# EAGLE design RFID (EAGLE 7.2.0)
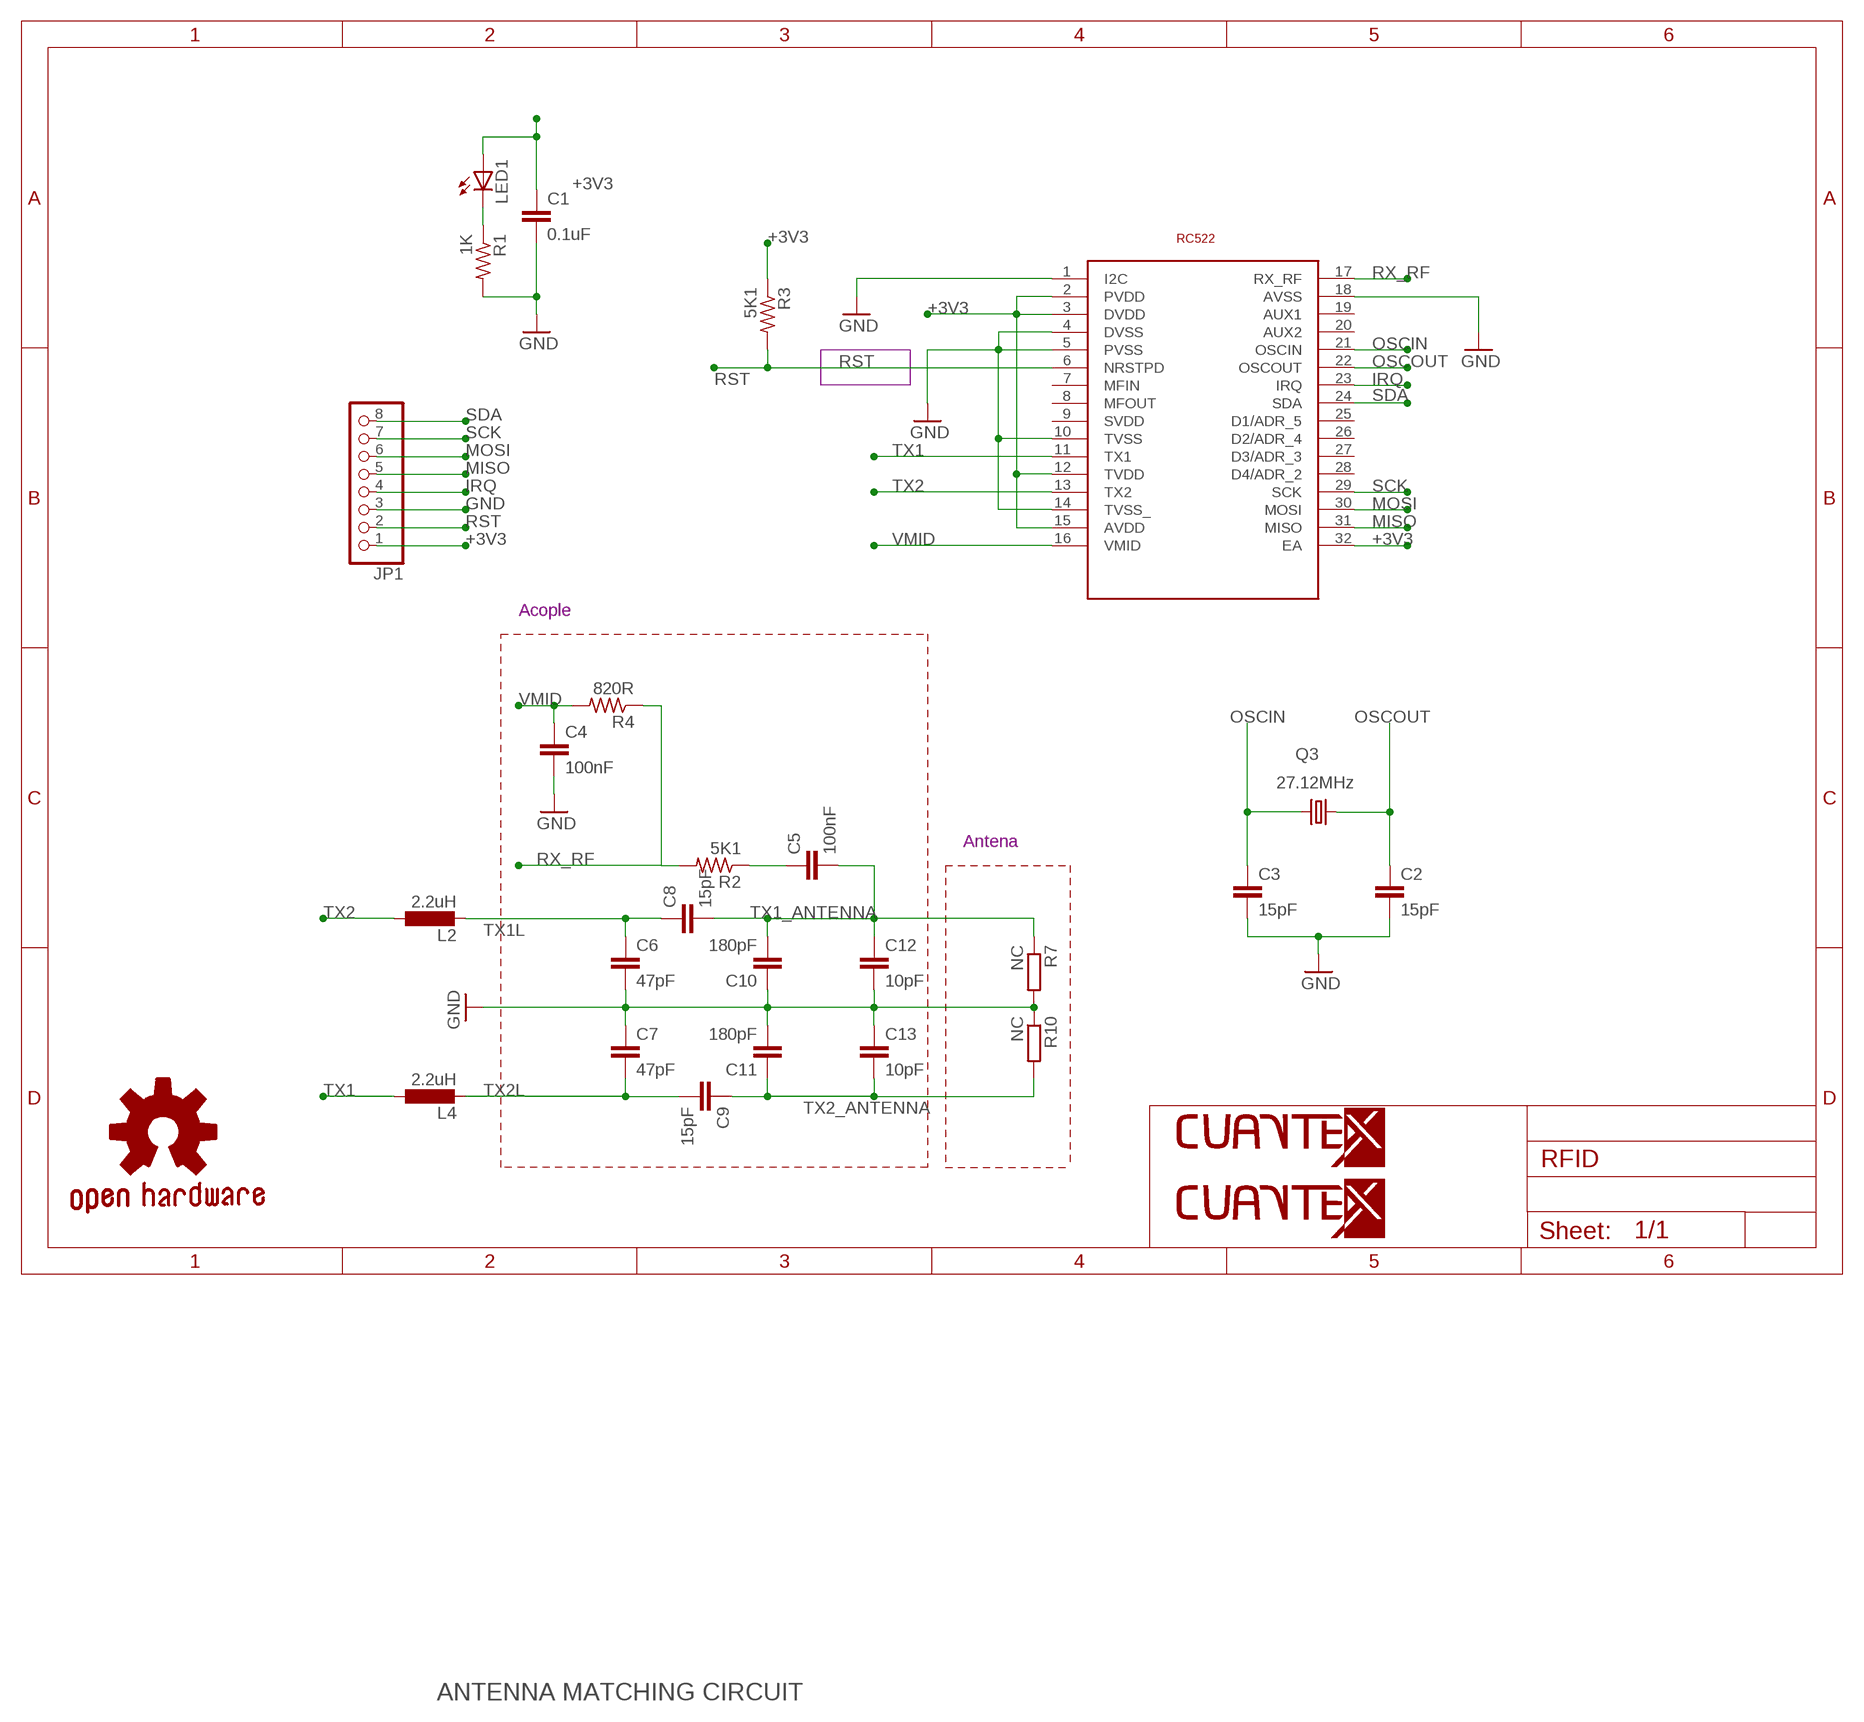
[diagram p0: schematic, sheet 1]

## Parts
C1  0.1uF  C-EUC0603K  [C0603K]
C2  15pF  C-EUC0603K  [C0603K]
C3  15pF  C-EUC0603K  [C0603K]
C4  100nF  C-EUC0603K  [C0603K]
C5  100nF  C-EUC0603K  [C0603K]
C6  47pF  C-EUC0603K  [C0603K]
C7  47pF  C-EUC0603K  [C0603K]
C8  15pF  C-EUC0603K  [C0603K]
C9  15pF  C-EUC0603K  [C0603K]
C10  180pF  C-EUC0603K  [C0603K]
C11  180pF  C-EUC0603K  [C0603K]
C12  10pF  C-EUC0603K  [C0603K]
C13  10pF  C-EUC0603K  [C0603K]
GOLD_ORB_SM1  OSHWLOGO_GOLD_ORB_SM  [OSHW2]
JP1  PINHD-1X8  [1X08]
L2  2.2uH  L-EUL2012C  [L2012C]
L4  2.2uH  L-EUL2012C  [L2012C]
LED1  LED_E  [LED_1206]
Q3  27.12MHz  CRYSTALHC49UP  [HC49UP]
R1  1K  R-US_R0603  [R0603]
R2  5K1  R-US_R0603  [R0603]
R3  5K1  R-US_R0603  [R0603]
R4  820R  R-US_R0603  [R0603]
R7  NC  R-EU_R0201  [R0201]
R10  NC  R-EU_R0201  [R0201]
U1  RC522  [HVQFN32]
U$1  LOGO-BOT-50MM  [B-50]
U$2  LOGO-TOP-20MM  [C-0]

## Nets
+3V3: C1.1 JP1.1 LED1.A R3.1 U1.2(PVDD) U1.3(DVDD) U1.12(TVDD) U1.15(AVDD) U1.32(EA)
GND: C1.2 C2.2 C3.2 C4.2 C6.2 C7.1 C10.1 C11.2 C12.2 C13.1 JP1.3 R1.2 R7.2 R10.1 U1.1(I2C) U1.4(DVSS) U1.5(PVSS) U1.10(TVSS) U1.14(TVSS_) U1.18(AVSS)
IRQ: JP1.4 U1.23(IRQ)
MISO: JP1.5 U1.31(MISO)
MOSI: JP1.6 U1.30(MOSI)
N$1: LED1.C R1.1
N$13: C5.1 R2.1
OSCIN: C3.1 Q3.2 U1.21(OSCIN)
OSCOUT: C2.1 Q3.1 U1.22(OSCOUT)
RST: JP1.2 R3.2 U1.6(NRSTPD)
RX_RF: R2.2 R4.1 U1.17(RX_RF)
SCK: JP1.7 U1.29(SCK)
SDA: JP1.8 U1.24(SDA)
TX1: L4.1 U1.11(TX1)
TX1_ANTENNA: C5.2 C8.2 C10.2 C12.1 R7.1
TX1L: C6.1 C8.1 L2.2
TX2: L2.1 U1.13(TX2)
TX2_ANTENNA: C9.1 C11.1 C13.2 R10.2
TX2L: C7.2 C9.2 L4.2
VMID: C4.1 R4.2 U1.16(VMID)
Unconnected: U1.7(MFIN) U1.8(MFOUT) U1.9(SVDD) U1.19(AUX1) U1.20(AUX2) U1.25(D1/ADR_5) U1.26(D2/ADR_4) U1.27(D3/ADR_3) U1.28(D4/ADR_2)

## Notes on the sheet
- Acople
- Antena
- ANTENNA MATCHING CIRCUIT

## Library data of the parts
C1 = resistor:C-EU: CAPACITOR, European symbol
C2-C13 = rcl:C-EU: CAPACITOR, European symbol
GOLD_ORB_SM1 = OPENHW:OSHWLOGO: These are Open-Source Hardware logos.
JP1 = pinhead:PINHD-1X8: PIN HEADER
L2 L4 = resistor:L-EU: INDUCTOR, European symbol
LED1 = eagle-ltspice:LED_E: LED Source: http://www.osram.convergy.de Source: www.luxeon.com Source: www.kingbright.com; SPICEMODEL: NONE; SPICEPREFIX: D; SPICETYPE: diode
Q3 = crystal:CRYSTAL: CRYSTAL; OC_FARNELL: unknown; OC_NEWARK: unknown
R1-R4 = rcl:R-US_: RESISTOR, American symbol
R7 R10 = rcl:R-EU_: RESISTOR, European symbol
U1 = MaoLib:RC522
U$1 = LOGOTIPOS:LOGO-BOT-50MM
U$2 = LOGOTIPOS:LOGO-TOP-20MM

## Board
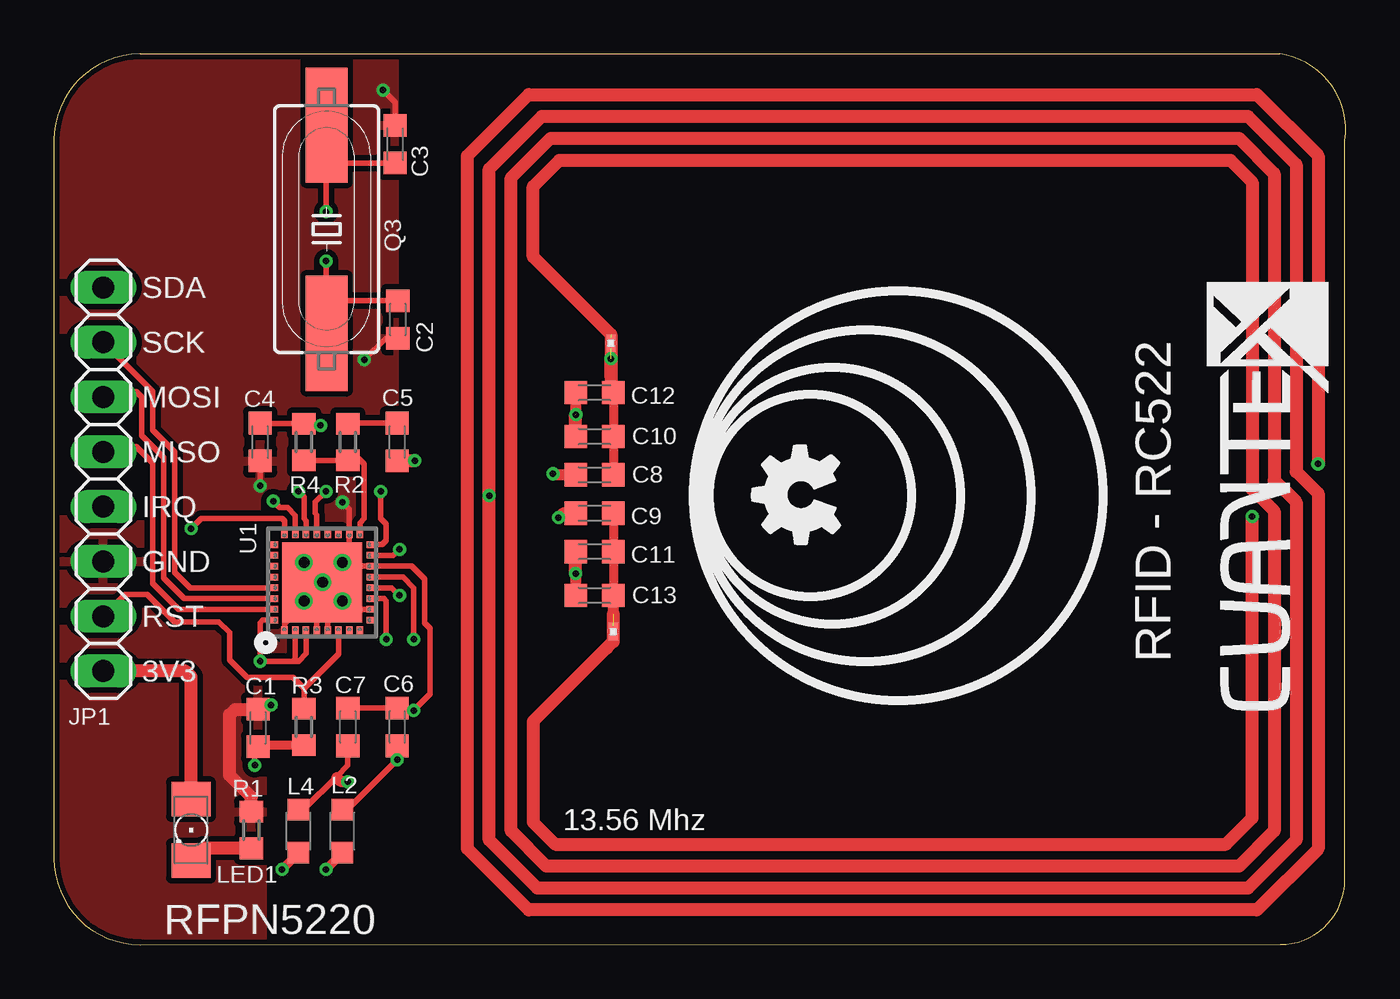
[diagram p1: board, top side]
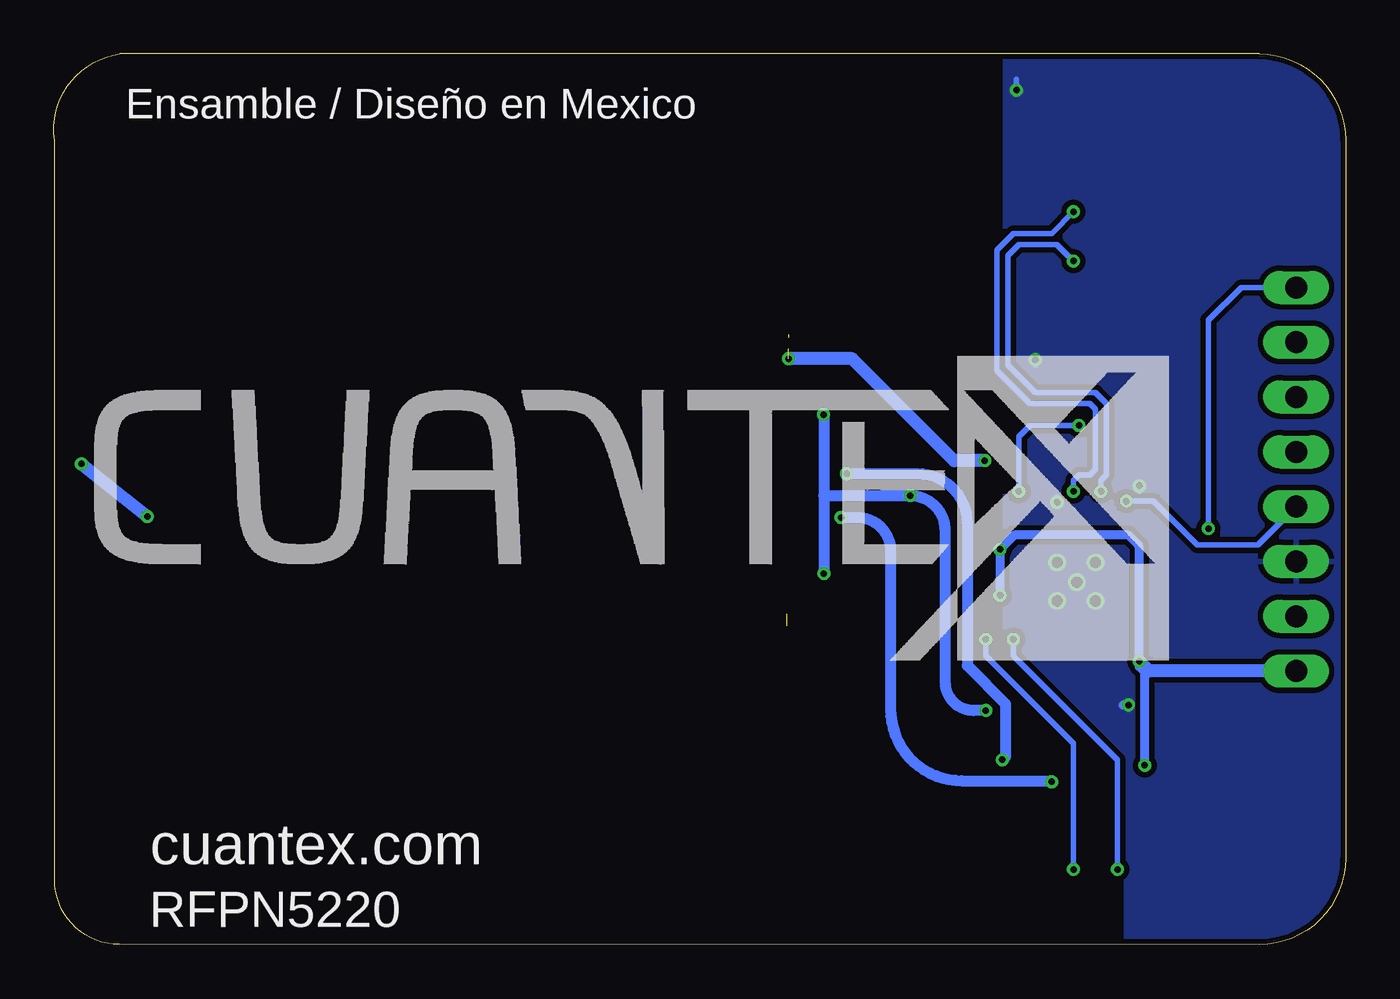
[diagram p2: board, bottom side, seen from below]

Size 59.85 x 41.28 mm. Coordinates in mm from the lower left corner, seen from the top.
Outline: 0,37.29 0,4 arc90 3.99,0 56.82,0.01 arc90 59.82,3.01 59.82,37.3 arc90 56.8,41.28 3.99,41.28 arc90 0,37.29
Copper layers (1*16): Top 0.035mm / dielectric 0.2mm / Bottom 0.035mm
Design rules "ODOLOGGER_HeTPpro_08_2014_4_layer *": minimum track width 8mil, minimum drill 5mil, track to track 5mil, track to pad 5mil, pad to pad 5mil, via to via 5mil, smd to smd 0mil, copper to edge 10mil, drill to drill 10mil, minimum pad ring 10mil, minimum via ring 6mil, stop-mask expansion 2mil, vias tented up to drill 100mil, thermal gap 10mil

### Footprints (pad centres in the part's own frame; a part is rotated, then mirrored left to right if it is on the bottom)
C0603K = smd 1.05 x 1.08: 1 -0.875,0; 2 0.875,0
1X08 = drill 1.016 long: 1 -8.89,0; 2 -6.35,0; 3 -3.81,0; 4 -1.27,0; 5 1.27,0; 6 3.81,0; 7 6.35,0; 8 8.89,0
L2012C = smd 1 x 1: 1 -1,0; 2 1,0
LED_1206 = smd 1.6 x 1.803: A -1.422,0; C 1.422,0
HC49UP = smd 5.334 x 1.93: 1 -4.826,0; 2 4.826,0
R0603 = smd 1 x 1.1: 1 -0.85,0; 2 0.85,0
R0201 = smd 0.28 x 0.43: 1 -0.255,0; 2 0.255,0
HVQFN32 = smd 0.5 x 0.3: 1 -2.3,1.75; 2 -2.3,1.25; 3 -2.3,0.75; 4 -2.3,0.25; 5 -2.3,-0.25; 6 -2.3,-0.75; 7 -2.3,-1.25; 8 -2.3,-1.75; 17 2.3,-1.75; 18 2.3,-1.25; 19 2.3,-0.75; 20 2.3,-0.25; 21 2.3,0.25; 22 2.3,0.75; 23 2.3,1.25; 24 2.3,1.75 | smd 0.3 x 0.5: 9 -1.75,-2.3; 10 -1.25,-2.3; 11 -0.75,-2.3; 12 -0.25,-2.3; 13 0.25,-2.3; 14 0.75,-2.3; 15 1.25,-2.3; 16 1.75,-2.3; 25 1.75,2.3; 26 1.25,2.3; 27 0.75,2.3; 28 0.25,2.3; 29 -0.25,2.3; 30 -0.75,2.3; 31 -1.25,2.3; 32 -1.75,2.3 | smd 3.7 x 3.7: TH 0,0

### Placement (x,y rotation side)
C1  9.46,10.05 90 top
C2  15.94,28.97 270 top
C3  15.81,37.1 90 top
C4  9.56,23.3 270 top
C5  15.91,23.3 270 top
C6  15.91,10.09 90 top
C7  13.62,10.09 270 top
C8  25.05,21.78 0 top
C9  25.05,20 180 top
C10  25.05,23.55 0 top
C11  25.05,18.22 180 top
C12  25.05,25.59 180 top
C13  25.05,16.19 0 top
GOLD_ORB_SM1  38.9,17.03 90 top
JP1  2.29,21.57 90 top
L2  13.37,5.27 90 top
L4  11.33,5.27 90 top
LED1  6.36,5.32 270 top
Q3  12.63,33.16 90 top
R1  9.15,5.32 90 top
R2  13.62,23.3 270 top
R3  11.59,10.09 90 top
R4  11.59,23.3 90 top
R7  25.81,27.87 90 top
R10  25.91,14.51 90 top
U1  12.43,16.79 90 top
U$1  8.15,13.04 0 top
U$2  59.1,10.82 90 top

### Tracks (layer width: path | path; a pad name or v marks a point on that pad's centre or on a via)
+3V3  (via drill 0.3)
  Top 0.254: U1.32 9.68,15.04 9.56,14.92 v9.56,13.14 11.08,13.14 | U1.15 15.73,18.04 v16.01,18.32 | U1.12 15.65,16.54 v16.01,16.19 | U1.3 11.68,13.49 11.33,13.14 11.08,13.14 | U1.2 11.18,13.24 11.08,13.14 | C1.1 9.3,9.02 v9.3,8.31
  Top 0.406: R3.1 9.53,9.24 C1.1
  Top 0.61: LED1.A 6.36,12.43 6.1,12.68 JP1.1
  Bottom 0.406: v16.01,16.19 v16.01,18.32 15.35,18.98 10.06,18.98 9.56,18.47 v9.56,13.14 9.56,12.89 9.3,12.63 v9.3,8.31
  Bottom 0.61: JP1.1 9.1,12.68 v9.56,13.14
GND  (via drill 0.3, 0.5)  (2 unrouted)
  Top 0.254: U1.10 13.11,15.54 | 13.11,15.54 12.72,15.54 12.6,15.43 | 12.6,15.43 12.68,15.35 U1.5 | U1.4 12.18,15.01 | 12.18,15.01 12.6,15.43 | U1.1 10.68,14.88 10.93,15.12 11.84,15.12 | 11.84,15.12 12.07,15.12 12.18,15.01 | 13.68,17.9 14.04,17.54 U1.14 16.58,17.54 17.18,16.95 17.18,14.92 17.43,14.66 17.43,11.62 v16.67,10.85 16.02,10.85 C6.2 C7.1 | 13.68,17.9 U1.18 13.68,20.19 v13.37,20.51 | C4.2 v9.56,21.27 | v11.59,17.71 v11.59,15.93 11.84,15.68 11.84,15.12 | 13.68,17.9 13.56,17.9 v13.37,17.71 v13.37,15.93 13.11,15.68 13.11,15.54 | C2.2 15.37,28.1 v14.38,27.11 | C3.2 15.81,39.04 v15.25,39.61
  Top 0.406: C1.2 9.88,10.92 v10.06,11.11
  Top 0.508: v24.17,17.2 C13.1 | C12.2 v24.17,24.58 v24.19,24.57 | C11.2 23.92,17.97 | 24.19,23.57 C10.1
  Top 0.61: v58.58,22.28 58.58,36.56 55.73,39.4 22,39.4 19.16,36.56 19.16,4.45 22,1.61 55.73,1.61 58.58,4.45 58.58,20.91 57.56,21.93 57.56,36.15 55.33,38.39 22.61,38.39 20.17,35.95 v20.17,20.81 20.17,4.86 22.41,2.62 55.33,2.62 57.56,4.86 57.56,20.51 56.55,21.52 56.55,35.75 54.92,37.37 23.02,37.37 21.19,35.54 21.19,5.27 22.81,3.64 54.92,3.64 56.55,5.27 56.55,20.1 55.53,21.12 55.53,35.34 54.51,36.36 23.42,36.36 22.21,35.14 22.21,31.88 25.81,28.28 25.81,26.91 | R10.1 25.91,14.05 22.21,10.35 22.21,5.67 23.22,4.66 54.31,4.66 55.53,5.88 v55.53,19.85 | C10.1 24.17,24.56 v24.19,24.57 | v24.17,17.2 C11.2 | R1.2 9.15,6.84 8.13,7.86 8.13,10.65 8.39,10.9 9.44,10.9 C1.2
  Bottom 0.254: v13.37,20.51 13.37,20.76 | v9.56,21.27 9.56,21.01 | v14.38,27.11 14.38,26.86 | v15.25,39.61 15.25,40.11
  Bottom 0.406: v10.06,11.11 10.32,11.11
  Bottom 0.508: v24.17,24.58 24.17,20.81 | 24.17,20.81 v20.17,20.81 arc90 18.55,19.18 18.55,12.17 arc-90 17.23,10.85 v16.67,10.85 | 24.17,20.81 v24.17,17.2
  Bottom 0.61: v55.53,19.85 v58.58,22.28
  other vias: 12.45,16.8
  pour Bottom (isolate 0.254): 0.01,41.13 15.75,41.13 15.75,13.7 10.17,8.11 10.17,-0.02 0.01,-0.02
  pour Top (isolate 0.254): 0.01,41.13 15.75,41.13 15.75,18.78 9.66,12.68 9.66,-0.02 0.01,-0.02
IRQ  (via drill 0.3)
  Top 0.254: U1.23 11.18,19.89 10.83,20.25 10.47,20.25 v10.17,20.56
  Bottom 0.254: v10.17,20.56 8.9,20.56 6.86,18.52 4.07,18.52 JP1.4
MISO
  Top 0.254: U1.31 5.78,15.54 4.58,16.75 4.58,22.33 3.82,23.1 2.55,23.1 JP1.5
MOSI
  Top 0.254: U1.30 6.04,16.04 5.09,17 5.09,22.59 4.07,23.6 4.07,25.38 3.82,25.64 2.55,25.64 JP1.6
N$1
  Top 0.61: R1.1 6.93,4.47 LED1.C
N$13
  Top 0.254: C5.1 13.64,24.17 R2.1
OSCIN  (via drill 0.3)
  Top 0.254: U1.21 12.18,19.91 12.1,20 12.1,20.51 v12.6,21.01 | v12.6,33.97 12.6,36.76 | 12.6,36.76 12.6,37.96 Q3.2 | C3.1 13.14,36.22 12.6,36.76
  Bottom 0.254: v12.6,21.01 12.6,21.52 12.35,21.78 11.84,21.78 11.59,22.03 11.59,24.82 11.84,25.08 14.64,25.08 16.16,26.6 16.16,32.19 15.4,32.95 13.62,32.95 v12.6,33.97
OSCOUT  (via drill 0.3)
  Top 0.254: U1.22 11.68,19.65 11.59,19.74 11.59,20.76 v11.33,21.01 | v12.6,31.68 12.6,29.14 | 12.6,29.14 12.6,28.37 Q3.1 | C2.1 13.31,29.85 12.6,29.14
  Bottom 0.254: v11.33,21.01 11.33,21.52 11.08,21.78 11.08,25.08 11.59,25.59 14.38,25.59 15.65,26.86 15.65,31.94 15.14,32.44 13.37,32.44 v12.6,31.68
RST
  Top 0.254: U1.6 13.18,13.47 11.59,11.87 | R3.2 11.59,11.87 | 11.59,11.87 11.08,12.38 8.95,12.38 8.13,13.19 8.13,14.46 7.63,14.97 5.59,14.97 4.32,16.24 3.31,16.24 JP1.2
RX_RF
  Top 0.254: U1.17 14.18,19.55 14.38,19.74 14.38,22.28 14.13,22.54 13.71,22.54 R2.2 R4.1
SCK
  Top 0.254: U1.29 6.31,16.54 5.59,17.25 5.59,22.84 4.58,23.86 4.58,25.64 JP1.7
SDA  (via drill 0.3)
  Top 0.254: U1.24 10.68,19.63 10.57,19.74 6.81,19.74 v6.36,19.29
  Bottom 0.254: v6.36,19.29 6.36,28.94 4.83,30.46 JP1.8
TX1  (via drill 0.3)
  Top 0.254: U1.11 15.29,16.04 15.4,15.93 v15.4,14.16
  Top 0.406: v10.57,3.49 10.57,3.5 L4.1
  Bottom 0.254: v15.4,14.16 15.4,13.39 10.57,8.57 v10.57,3.49
TX1_ANTENNA  (via drill 0.3)  (1 unrouted)
  Top 0.406: 25.81,26.35 25.81,25.59 C12.1 C10.2 C8.2 | 16.05,22.28 C5.2
  Top 0.508: 16.05,22.28 arc-90 C5.2
  Top 0.61: 25.81,26.35 v25.81,27.16 25.81,25.7 C12.1 | 16.05,22.28 16.2,22.44 v16.72,22.44
  Bottom 0.61: v16.72,22.44 18.14,22.44 22.87,27.16 25.76,27.16 v25.81,27.16
TX1L  (via drill 0.3)
  Top 0.254: L2.2 13.6,6.27 v15.91,8.57 C6.1
  Top 0.508: C8.1 23.17,21.78 v23.12,21.83
  Bottom 0.508: v23.12,21.83 19.82,21.83 arc90 17.53,19.54 17.53,12.94 15.75,11.16 15.75,8.72 v15.91,8.57
TX2  (via drill 0.3)
  Top 0.254: U1.13 16.17,17.04 16.67,16.54 v16.67,14.16 | v12.6,3.49 12.6,3.5
  Top 0.406: L2.1 13.37,4.25 v12.6,3.49
  Bottom 0.254: v16.67,14.16 16.67,13.39 12.6,9.33 v12.6,3.49
TX2_ANTENNA  (1 unrouted)
  Top 0.406: C9.1 C11.1 C13.2
  Top 0.508: C13.2 25.91,16.19 25.91,15.32
  Top 0.61: 25.91,15.32 25.91,14.05 25.61,13.75
TX2L  (via drill 0.3)
  Top 0.254: L4.2 11.57,6.27 13.11,7.81 | 13.11,7.81 13.62,8.31 C7.2 | 13.11,7.81 13.11,7.75
  Top 0.508: v13.62,7.55 13.32,7.55 13.11,7.75 | C9.2 23.58,20 v23.37,19.79
  Bottom 0.508: v23.37,19.79 22.61,19.79 arc90 21.09,18.27 21.09,10.9 arc-90 17.79,7.6 13.67,7.6 arc90 v13.62,7.55
VMID  (via drill 0.3)
  Top 0.254: U1.16 15.21,18.54 15.4,18.73 15.4,19.49 15.14,19.74 v15.14,21.01 | v12.35,24.06 11.68,24.06 R4.2 9.58,24.15 C4.1
  Bottom 0.254: v15.14,21.01 15.14,23.55 14.64,24.06 v12.35,24.06

### Text on the board
tPlace: SDA | SCK | MOSI | MISO | IRQ | GND | RST | RFID - RC522 | 3V3 | 13.56 Mhz | RFPN5220
bPlace: Ensamble / Diseño en Mexico | cuantex.com | RFPN5220